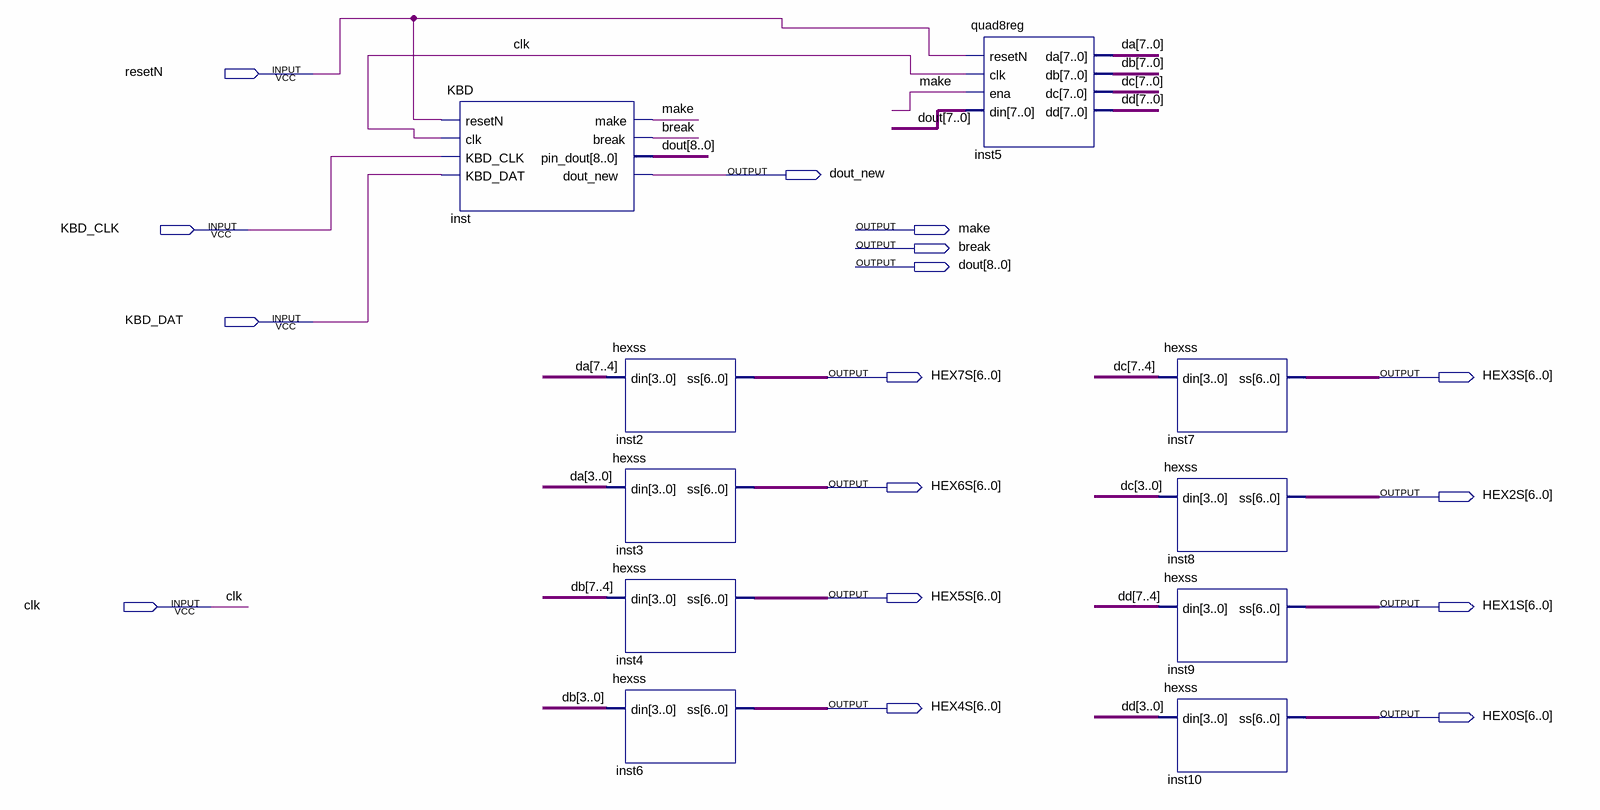
[diagram p0: schematic sheet]
// Quartus schematic TEST_KBD.bdf as structural Verilog: 10 symbols, 16 pins
module TEST_KBD (
  input  resetN,
  input  KBD_CLK,
  input  KBD_DAT,
  input  clk,
  output dout_new,
  output make,
  output \break ,
  output [8:0] dout,
  output [6:0] HEX7S,
  output [6:0] HEX3S,
  output [6:0] HEX6S,
  output [6:0] HEX2S,
  output [6:0] HEX5S,
  output [6:0] HEX1S,
  output [6:0] HEX4S,
  output [6:0] HEX0S
);

  wire [7:0] da, db, dc, dd;

  KBD inst (
    .resetN(resetN), .clk(clk), .KBD_CLK(KBD_CLK), .KBD_DAT(KBD_DAT), .make(make), .\break (\break ),
    .pin_dout(dout), .dout_new(dout_new));
  hexss inst2 (.din(da[7:4]), .ss(HEX7S));
  hexss inst3 (.din(da[3:0]), .ss(HEX6S));
  hexss inst4 (.din(db[7:4]), .ss(HEX5S));
  hexss inst6 (.din(db[3:0]), .ss(HEX4S));
  quad8reg inst5 (.resetN(resetN), .clk(clk), .ena(make), .din(dout[7:0]), .da(da), .db(db), .dc(dc), .dd(dd));
  hexss inst7 (.din(dc[7:4]), .ss(HEX3S));
  hexss inst8 (.din(dc[3:0]), .ss(HEX2S));
  hexss inst9 (.din(dd[7:4]), .ss(HEX1S));
  hexss inst10 (.din(dd[3:0]), .ss(HEX0S));
endmodule
